# Altium schematic sheet Steering Wheel Interface.SchDoc: Title
size B; Organization: Midnight Sun Solar Rayce Car Team; Address1: University of Waterloo; Address2: 200 University Ave W; Address3: Waterloo, ON, Canada; Address4: N2L 3E9; Website: www.uwmidsun.com; ProjectName: ProjectName
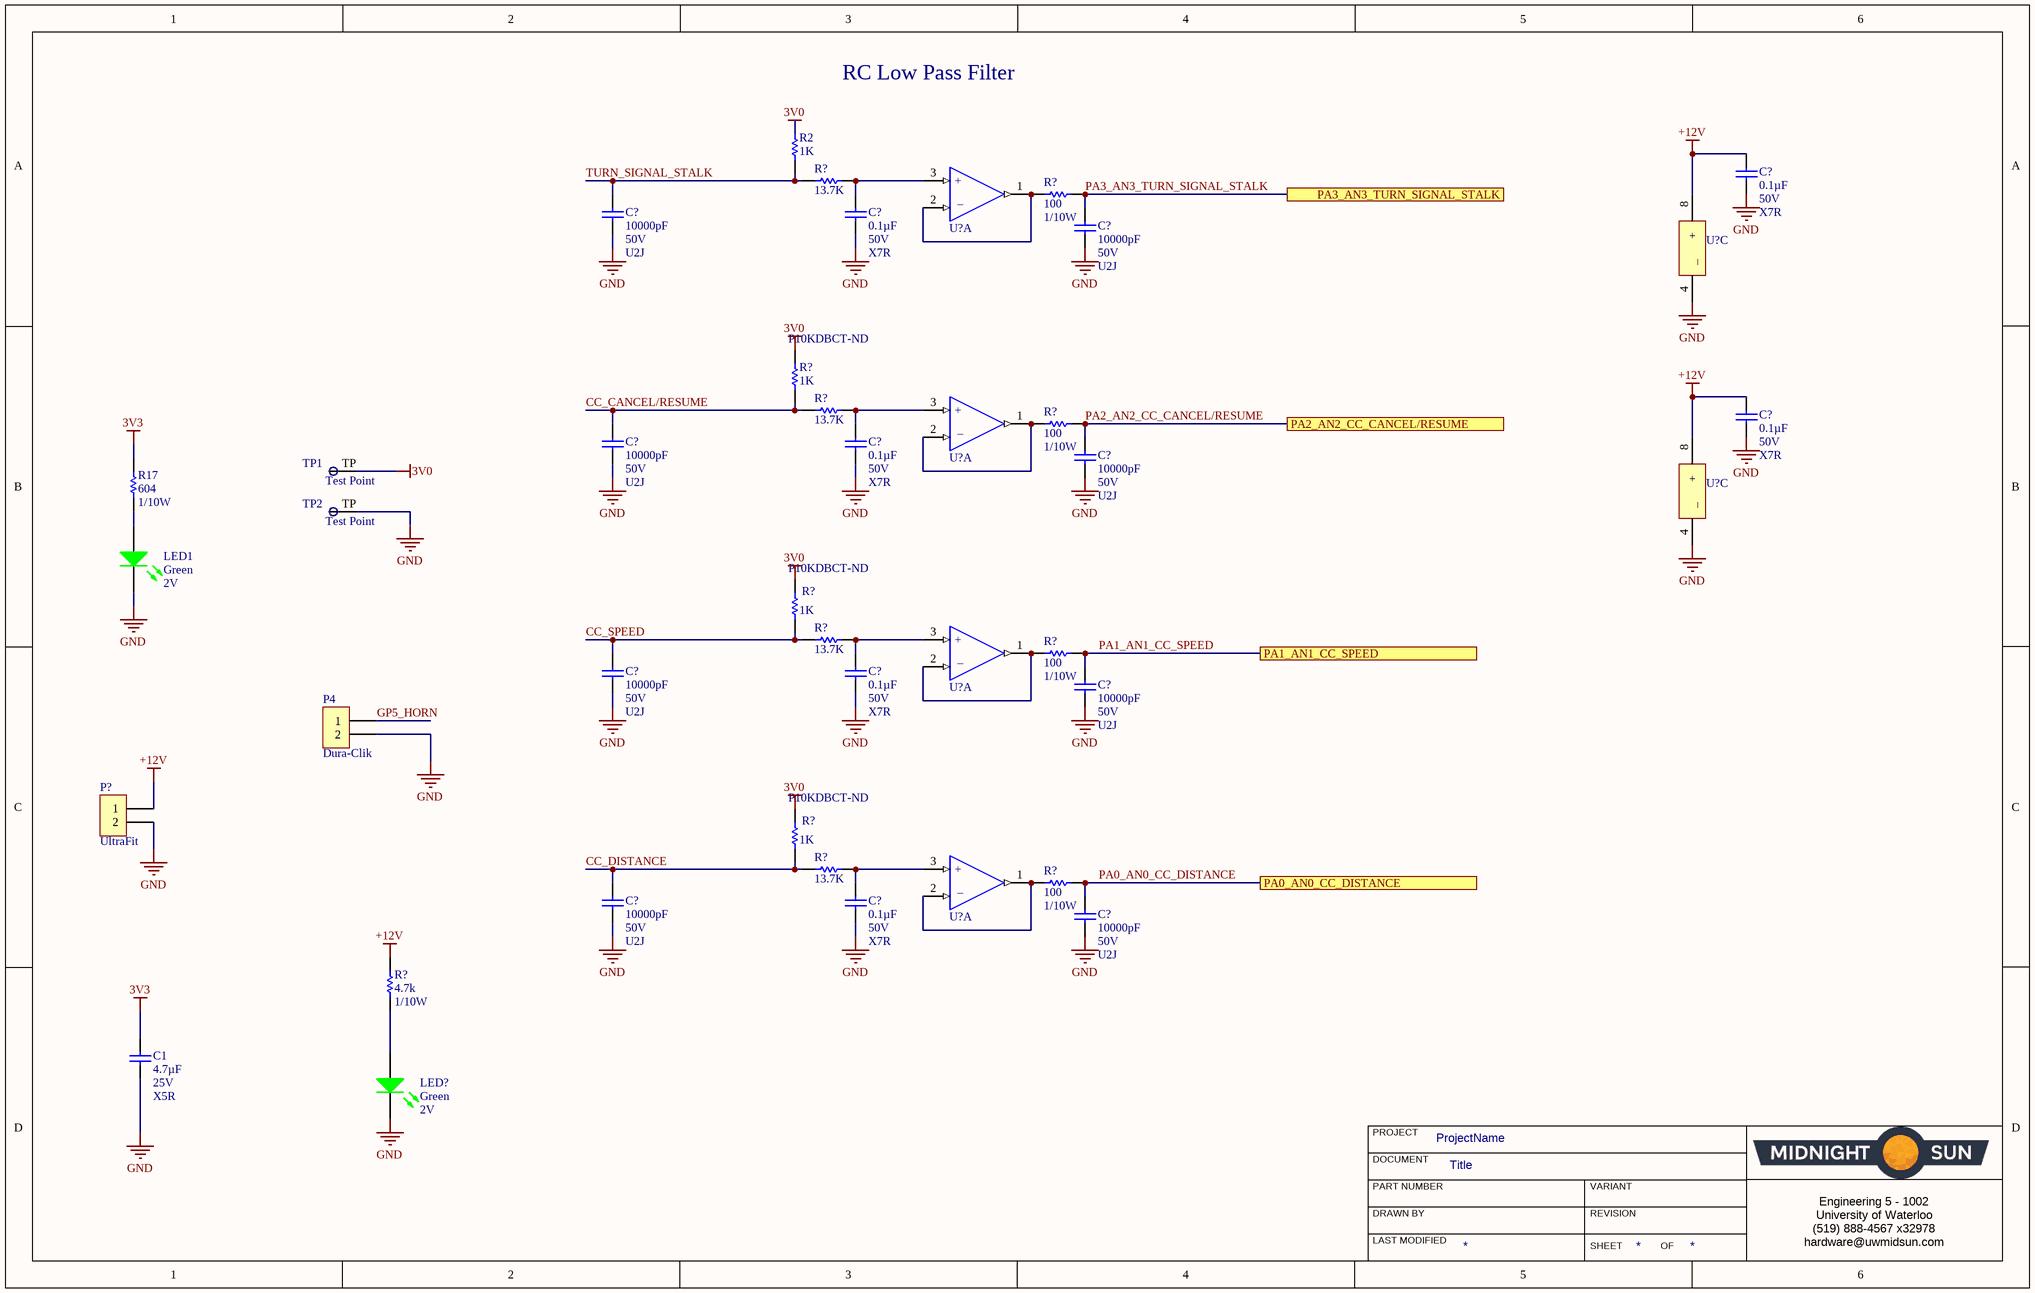
[diagram p0: Steering Wheel Interface.SchDoc]

## Parts
(Parts that share a designator on the sheet are numbered #1, #2 ... from top to bottom, then left to right.)
C1  Capacitance: 4.7µF  Voltage: 25V  Temperature Coefficient: X5R  [CAP, 0603]  (hidden comment: CAP CER 4.7UF 25V 10% X5R 0603)
C?#1  Capacitance: 0.1µF  Voltage: 50V  Temperature Coefficient: X7R  [CAP, 0603]  (hidden comment: CAP CER 0.1UF 50V 10% X7R 0603)
C?#2  Capacitance: 10000pF  Voltage: 50V  Temperature Coefficient: U2J  [CAP, 0603]  (hidden comment: CAP CER 10nF 50V 5% X7R 0603)
C?#3  Capacitance: 0.1µF  Voltage: 50V  Temperature Coefficient: X7R  [CAP, 0603]  (hidden comment: CAP CER 0.1UF 50V 10% X7R 0603)
C?#4  Capacitance: 10000pF  Voltage: 50V  Temperature Coefficient: U2J  [CAP, 0603]  (hidden comment: CAP CER 10nF 50V 5% X7R 0603)
C?#5  Capacitance: 0.1µF  Voltage: 50V  Temperature Coefficient: X7R  [CAP, 0603]  (hidden comment: CAP CER 0.1UF 50V 10% X7R 0603)
C?#6  Capacitance: 10000pF  Voltage: 50V  Temperature Coefficient: U2J  [CAP, 0603]  (hidden comment: CAP CER 10nF 50V 5% X7R 0603)
C?#7  Capacitance: 0.1µF  Voltage: 50V  Temperature Coefficient: X7R  [CAP, 0603]  (hidden comment: CAP CER 0.1UF 50V 10% X7R 0603)
C?#8  Capacitance: 10000pF  Voltage: 50V  Temperature Coefficient: U2J  [CAP, 0603]  (hidden comment: CAP CER 10nF 50V 5% X7R 0603)
C?#9  Capacitance: 10000pF  Voltage: 50V  Temperature Coefficient: U2J  [CAP, 0603]  (hidden comment: CAP CER 10nF 50V 5% X7R 0603)
C?#10  Capacitance: 0.1µF  Voltage: 50V  Temperature Coefficient: X7R  [CAP, 0603]  (hidden comment: CAP CER 0.1UF 50V 10% X7R 0603)
C?#11  Capacitance: 10000pF  Voltage: 50V  Temperature Coefficient: U2J  [CAP, 0603]  (hidden comment: CAP CER 10nF 50V 5% X7R 0603)
C?#12  Capacitance: 10000pF  Voltage: 50V  Temperature Coefficient: U2J  [CAP, 0603]  (hidden comment: CAP CER 10nF 50V 5% X7R 0603)
C?#13  Capacitance: 0.1µF  Voltage: 50V  Temperature Coefficient: X7R  [CAP, 0603]  (hidden comment: CAP CER 0.1UF 50V 10% X7R 0603)
C?#14  Capacitance: 10000pF  Voltage: 50V  Temperature Coefficient: U2J  [CAP, 0603]  (hidden comment: CAP CER 10nF 50V 5% X7R 0603)
LED1  Color: Green  Voltage - Forward (Vf) (Typ): 2V  [LED_0603]  (hidden comment: LED GREEN CLEAR 2V 0603)
LED?  Color: Green  Voltage - Forward (Vf) (Typ): 2V  [LED_0603]  (hidden comment: LED GREEN CLEAR 2V 0603)
P4  Dura-Clik  [CONN, 2POS Dura-Click Vertical]
P?  Series: UltraFit  [CONN, 2POS ULTRA-FIT]  (hidden comment: CONN 2POS ULTRA-FIT 0.138")
R2  1K  [RES, 0603]
R17  Resistance: 604  Power: 1/10W  [RES, 0603]  (hidden comment: RES 604 OHM 1% 1/10W 0603)
R?#1  13.7K  [RES 1206]
R?#2  Resistance: 100  Power: 1/10W  [RES, 0603]  (hidden comment: RES 100 OHM 1% 1/10W 0603)
R?#3  1K  Supplier Part Number 1: P10KDBCT-ND  [RES, 0603]
R?#4  13.7K  [RES 1206]
R?#5  Resistance: 100  Power: 1/10W  [RES, 0603]  (hidden comment: RES 100 OHM 1% 1/10W 0603)
R?#6  1K  Supplier Part Number 1: P10KDBCT-ND  [RES, 0603]
R?#7  13.7K  [RES 1206]
R?#8  Resistance: 100  Power: 1/10W  [RES, 0603]  (hidden comment: RES 100 OHM 1% 1/10W 0603)
R?#9  1K  Supplier Part Number 1: P10KDBCT-ND  [RES, 0603]
R?#10  13.7K  [RES 1206]
R?#11  Resistance: 100  Power: 1/10W  [RES, 0603]  (hidden comment: RES 100 OHM 1% 1/10W 0603)
R?#12  Resistance (Ohms): 4.7k  Power (Watts): 1/10W  [RES, 0603]  (hidden comment: RES 4.7K OHM 1% 1/10W 0603)
TP1  Test Point  [Test Point]  (no BOM)
TP2  Test Point  [Test Point]  (no BOM)
U?#1  IC OP AMP DUAL GP RR 10MHZ 8-VSSOP  [IC OP AMP GP RR 10MHZ 8-VSSOP]  (value not drawn)  (part A of 3)
U?#2  IC OP AMP DUAL GP RR 10MHZ 8-VSSOP  [IC OP AMP GP RR 10MHZ 8-VSSOP]  (value not drawn)  (part C of 3)
U?#3  IC OP AMP DUAL GP RR 10MHZ 8-VSSOP  [IC OP AMP GP RR 10MHZ 8-VSSOP]  (value not drawn)  (part A of 3)
U?#4  IC OP AMP DUAL GP RR 10MHZ 8-VSSOP  [IC OP AMP GP RR 10MHZ 8-VSSOP]  (value not drawn)  (part C of 3)
U?#5  IC OP AMP DUAL GP RR 10MHZ 8-VSSOP  [IC OP AMP GP RR 10MHZ 8-VSSOP]  (value not drawn)  (part A of 3)
U?#6  IC OP AMP DUAL GP RR 10MHZ 8-VSSOP  [IC OP AMP GP RR 10MHZ 8-VSSOP]  (value not drawn)  (part A of 3)

## Ports
PA0_AN0_CC_DISTANCE, PA1_AN1_CC_SPEED, PA2_AN2_CC_CANCEL/RESUME, PA3_AN3_TURN_SIGNAL_STALK

## Nets
3V0: R2.1 R?#3.1 R?#6.1 R?#9.1 TP1.TP
3V3: C1.1 R17.1
+12V: C?#1.1 C?#5.1 P?.1 R?#12.1 U?#2.8(+) U?#4.8(+)
GND: C1.2 C?#1.2 C?#2.2 C?#3.2 C?#4.2 C?#5.2 C?#6.2 C?#7.2 C?#8.2 C?#9.2 C?#10.2 C?#11.2 C?#12.2 C?#13.2 C?#14.2 LED1.2(K) LED?.2(K) P4.2 P?.2 TP2.TP U?#2.4(_) U?#4.4(_)
CC_CANCEL/RESUME: C?#6.1 R?#3.2 R?#4.2
CC_DISTANCE: C?#12.1 R?#9.2 R?#10.2
CC_SPEED: C?#9.1 R?#6.2 R?#7.2
GP5_HORN: P4.1
PA0_AN0_CC_DISTANCE: C?#14.1 R?#11.1 ; port PA0_AN0_CC_DISTANCE
PA1_AN1_CC_SPEED: C?#11.1 R?#8.1 ; port PA1_AN1_CC_SPEED
PA2_AN2_CC_CANCEL/RESUME: C?#8.1 R?#5.1 ; port PA2_AN2_CC_CANCEL/RESUME
PA3_AN3_TURN_SIGNAL_STALK: C?#4.1 R?#2.1 ; port PA3_AN3_TURN_SIGNAL_STALK
TURN_SIGNAL_STALK: C?#2.1 R2.2 R?#1.2
NetC?#3_1: C?#3.1 R?#1.1 U?#1.3(+IN_A)
NetC?#7_1: C?#7.1 R?#4.1 U?#3.3(+IN_A)
NetC?#10_1: C?#10.1 R?#7.1 U?#5.3(+IN_A)
NetC?#13_1: C?#13.1 R?#10.1 U?#6.3(+IN_A)
NetLED1_1: LED1.1(A) R17.2
NetLED?_1: LED?.1(A) R?#12.2
NetR?#2_2: R?#2.2 U?#1.1(OUT_A) U?#1.2(-IN_A)
NetR?#5_2: R?#5.2 U?#3.1(OUT_A) U?#3.2(-IN_A)
NetR?#8_2: R?#8.2 U?#5.1(OUT_A) U?#5.2(-IN_A)
NetR?#11_2: R?#11.2 U?#6.1(OUT_A) U?#6.2(-IN_A)

## Notes on the sheet
- RC Low Pass Filter
- PROJECT
- DOCUMENT
- DRAWN BY
- LAST MODIFIED
- PART NUMBER
- REVISION
- SHEET
- VARIANT
- OF
- Engineering 5 - 1002
  University of Waterloo
  (519) 888-4567 x32978
  hardware@uwmidsun.com

## Library data of the parts
C1 = CAP CER 4.7UF 25V 10% X5R 0603: 4.7µF ±10% 25V Ceramic Capacitor X5R 0603 (1608 Metric); Manufacturer 1: Murata Electronics North America; Manufacturer Part Number 1: GRM188R61E475KE11D; Supplier 1: Digi-Key; Supplier Part Number 1: 490-7203-1-ND; Packaging: Cut Tape (CT); Part Status: Active; Operating Temperature: -55°C ~ 85°C; Ratings: -; Mounting Type: Surface Mount, MLCC; Package / Case: 0603 (1608 Metric); Size / Dimension: 0.063" L x 0.031" W (1.60mm x 0.80mm); Height - Seated (Max): -; Thickness (Max): 0.031" (0.80mm); Lead Spacing: -; Lead Style: -; ComponentLink1URL: http://www.murata.com/~/media/webrenewal/support/library/catalog/products/capacitor/mlcc/c02e.ashx; ComponentLink1Description: http://www.murata.com/~/media/webrenewal/support/library/catalog/products/capacitor/mlcc/c02e.ashx; Tolerance: ±10%
C?#1 C?#3 C?#5 C?#7 C?#10 C?#13 = CAP CER 0.1UF 50V 10% X7R 0603: 0.10µF ±10% 50V Ceramic Capacitor X7R 0603 (1608 Metric); Manufacturer 1: AVX Corporation; Manufacturer Part Number 1: 06035C104KAT2A; Supplier 1: Digi-Key; Supplier Part Number 1: 478-5052-1-ND; Packaging: Cut Tape (CT); Part Status: Active; Operating Temperature: -55°C ~ 125°C; Ratings: -; Mounting Type: Surface Mount, MLCC; Package / Case: 0603 (1608 Metric); Size / Dimension: 0.063" L x 0.032" W (1.60mm x 0.81mm); Height - Seated (Max): -; Thickness (Max): 0.035" (0.90mm); Lead Spacing: -; Lead Style: -; ComponentLink1URL: http://datasheets.avx.com/X7RDielectric.pdf; ComponentLink1Description: http://datasheets.avx.com/X7RDielectric.pdf; Tolerance: ±10%
C?#2 C?#4 C?#6 C?#8 C?#9 C?#11 C?#12 C?#14 = CAP CER 10nF 50V 5% X7R 0603: 10000pF ±5% 50V Ceramic Capacitor U2J 0603 (1608 Metric); Manufacturer 1: KEMET; Manufacturer Part Number 1: C0603C103J5JAC7867; Supplier 1: Digi-Key; Supplier Part Number 1: 399-13384-1-ND; Packaging: Cut Tape (CT); Part Status: Active; Operating Temperature: -55°C ~ 125°C; Ratings: -; Failure Rate: -; Mounting Type: Surface Mount, MLCC; Package / Case: 0603 (1608 Metric); Size / Dimension: 0.063" L x 0.032" W (1.60mm x 0.80mm); Height - Seated (Max): -; Thickness (Max): 0.034" (0.87mm); Lead Spacing: -; Lead Style: -; ComponentLink1URL: http://www.kemet.com/docfinder?Partnumber=C0603C103J5JAC7867; ComponentLink1Description: http://www.kemet.com/docfinder?Partnumber=C0603C103J5JAC7867; Tolerance: ±5%
LED1 LED? = LED GREEN CLEAR 2V 0603: Green 572nm LED Indication - Discrete 2V 0603 (1608 Metric); Manufacturer: Wurth Electronics Inc.; Manufacturer Part Number: 150060VS75000; Lens Color: Colorless; Millicandela Rating: 40mcd; Lens Style/Size: Rectangle with Flat Top, 1.10mm x 0.70mm; Current - Test: 20mA; Viewing Angle: 140°; Wavelength - Dominant: 570nm; Supplier 1: Digi-Key; RoHS: RoHS Compliant; Category: Optoelectronics; Stock 1: 9408; Pricing 1: 1=0.21, 100=0.1617, 500=0.13964 (CAD); Packaging: Cut Tape (CT); Part Status: Active; Lens Transparency: Clear; Mounting Type: Surface Mount; Wavelength - Peak: 572nm; Features: -; Package / Case: 0603 (1608 Metric); Supplier Device Package: 0603; Size / Dimension: 1.60mm L x 0.80mm W; Height (Max): 0.80mm; ComponentLink1URL: http://katalog.we-online.de/led/datasheet/150060VS75000.pdf; ComponentLink1Description: http://katalog.we-online.de/led/datasheet/150060VS75000.pdf; Supplier Part Number 1: 732-4980-1-ND
P4 = CONN 2POS DURA-CLIK 0.079" VERT: 2 Positions Header, Shrouded Connector 0.079" (2.00mm) Surface Mount, Vertical Tin; Manufacturer: Molex, LLC; Manufacturer Part Number: 5600200220; Style: Board to Cable/Wire; Shrouding: Shrouded - 4 Wall; Number of Positions: 2; Number of Positions Loaded: All; Mated Stacking Heights: 9.3mm; Supplier 1: Digi-Key; RoHS: RoHS Compliant; Category: Connectors, Interconnects; Stock 1: 11912; Pricing 1: 1=1.16, 10=1.012, 25=0.952, 50=0.9122, 100=0.8727, 250=0.79336 (CAD); Packaging: Cut Tape (CT); Part Status: Active; Connector Type: Header; Contact Type: Male Pin; Pitch - Mating: 0.079" (2.00mm); Number of Rows: 1; Row Spacing - Mating: -; Mounting Type: Surface Mount; Termination: Solder; Fastening Type: Latch Lock; Contact Length - Mating: -; Contact Length - Post: -; Overall Contact Length: -; Insulation Height: 0.315" (8.00mm); Contact Shape: Square; Contact Finish - Mating: Tin; Contact Finish Thickness - Mating: -; Contact Finish - Post: Tin; Contact Material: Copper Alloy; Insulation Material: Polyamide (PA), Nylon; Features: Solder Retention; Operating Temperature: -; Ingress Protection: -; Material Flammability Rating: -; Insulation Color: Natural; Current Rating: -; Voltage Rating: -; Contact Finish Thickness - Post: -; Applications: Automotive, Industrial; ComponentLink1URL: http://www.molex.com/pdm_docs/sd/5600200220_sd.pdf; ComponentLink1Description: http://www.molex.com/pdm_docs/sd/5600200220_sd.pdf; Supplier Part Number 1: WM10862CT-ND
P? = CONN 2POS ULTRA-FIT 0.138": 2 Positions Header, Shrouded Connector 0.138" (3.50mm) Through Hole Gold; Manufacturer 1: Molex, LLC; Manufacturer Part Number 1: 1722861302; Style: Board to Board or Cable; Shrouding: Shrouded - 4 Wall; Number of Positions: 2; Number of Positions Loaded: All; Contact Length - Post: 0.126" (3.20mm); Material Flammability Rating: UL94 V-0; Mated Stacking Heights: 26.99mm; Voltage: 400V; Supplier 1: Digi-Key; Supplier Part Number 1: WM11673-ND; Packaging: Tray; Part Status: Active; Connector Type: Header; Contact Type: Male Pin; Pitch - Mating: 0.138" (3.50mm); Number of Rows: 1; Row Spacing - Mating: -; Mounting Type: Through Hole; Termination: Kinked Pin, Solder; Fastening Type: Latch Holder; Contact Length - Mating: -; Overall Contact Length: -; Insulation Height: 0.465" (11.80mm); Contact Shape: Square; Contact Finish - Mating: Gold; Contact Finish Thickness - Mating: 30µin (0.76µm); Contact Finish - Post: Tin; Contact Material: Copper Alloy; Insulation Material: Liquid Crystal Polymer (LCP); Operating Temperature: -40°C ~ 120°C; Ingress Protection: -; Insulation Color: Black; Current Rating: -; Contact Finish Thickness - Post: 60µin (1.52µm); ComponentLink1URL: http://www.molex.com/pdm_docs/sd/1722861302_sd.pdf; ComponentLink1Description: http://www.molex.com/pdm_docs/sd/1722861302_sd.pdf
R2 R?#3 R?#6 R?#9 = RES SMD 1K OHM 0.1% 1/10W 0603: 1 kOhms ±0.1% 0.1W, 1/10W Chip Resistor 0603 (1608 Metric) Automotive AEC-Q200 Thin Film; Manufacturer: Panasonic; Manufacturer Part Number: ERA3AEB103V; Resistance: 10kR; Power Rating: 100mW; Voltage Rating: 75V; Temperature Coefficient: 25ppm/°C; ComponentLink1URL: https://www.digikey.ca/product-detail/en/panasonic-electronic-components/ERA-3AEB102V/P1.0KDBCT-ND/1466052; ComponentLink1Description: Digikey; Supplier 1: Digi-Key; RoHS: Yes; Stock 1: 2747820; Pricing 1: 1 = 0.35000, 10 = 0.30000, 100 = 0.11720, 1000 = 0.04906, 2500 = 0.04498 (USD); Mount: Surface Mount; Case/Package: 0603; Number of Pins: 2; Case Code (Metric): 1608; Case Code (Imperial): 0603; Contact Plating: Tin; Min Operating Temperature: -55°C; Max Operating Temperature: 155°C; Packaging: Tape and Reel; Tolerance: 0.1%; Package Quantity: 5000; Composition: Metal Film,Thin Film; Number of Terminations: 2; Termination: SMD/SMT; Military Standard: Not; Max Power Dissipation: 100mW; Voltage Rating (DC): 75V; Length: 1.6mm; Height: 0.45mm; Width: 0.8mm; Depth: 0.8mm; Radiation Hardening: No; REACH SVHC: No SVHC; Lead Free: Lead Free; ComponentLink2URL: http://www.farnell.com/datasheets/485442.pdf; ComponentLink2Description: http://www.farnell.com/datasheets/485442.pdf; ComponentLink3URL: http://industrial.panasonic.com/www-data/pdf/AOA0000/AOA0000CE26.pdf; ComponentLink3Description: http://industrial.panasonic.com/www-data/pdf/AOA0000/AOA0000CE26.pdf; ComponentLink4URL: http://www.farnell.com/datasheets/2052875.pdf; ComponentLink4Description: http://www.farnell.com/datasheets/2052875.pdf; ComponentLink5URL: http://www.farnell.com/datasheets/1776116.pdf; ComponentLink5Description: http://www.farnell.com/datasheets/1776116.pdf; ComponentLink6URL: http://uk.rs-online.com/webdocs/148c/0900766b8148c4ab.pdf; ComponentLink6Description: http://uk.rs-online.com/webdocs/148c/0900766b8148c4ab.pdf; ComponentLink7URL: http://www.farnell.com/datasheets/2059650.pdf; ComponentLink7Description: http://www.farnell.com/datasheets/2059650.pdf; ComponentLink8URL: http://www.produktinfo.conrad.com/datenblaetter/450000-474999/451250-da-01-en-WIDERSTAND_0603_ERA.pdf; ComponentLink8Description: http://www.produktinfo.conrad.com/datenblaetter/450000-474999/451250-da-01-en-WIDERSTAND_0603_ERA.pdf
  R2: Supplier Part Number 1: P10KDBCT-ND
R17 = RES 604 OHM 1% 1/10W 0603: RES SMD 604 OHM 1% 1/10W 0603; Manufacturer 1: Yageo; Manufacturer Part Number 1: RC0603FR-07604RL; Temperature Coefficient: ±100ppm/°C; Supplier 1: Digi-Key; Supplier Part Number 1: 311-604HRCT-ND; Packaging: Cut Tape (CT); Part Status: Active; Composition: Thick Film; Operating Temperature: -55°C ~ 155°C; Package / Case: 0603 (1608 Metric); Supplier Device Package: 0603; Size / Dimension: 0.063" L x 0.031" W (1.60mm x 0.80mm); Height - Seated (Max): 0.022" (0.55mm); Failure Rate: -; ComponentLink1URL: http://www.yageo.com/documents/recent/PYu-RC_Group_51_RoHS_L_7.pdf; ComponentLink1Description: http://www.yageo.com/documents/recent/PYu-RC_Group_51_RoHS_L_7.pdf; Tolerance: ±1%
R?#1 R?#4 R?#7 R?#10 = RES 13.7K OHM 1% 1/4W 1206: 13.7 kOhms ±1% 0.25W, 1/4W Chip Resistor 1206 (3216 Metric) Moisture Resistant Thick Film; Manufacturer: Yageo; Manufacturer Part Number: RC1206FR-0713K7L; Resistance: 13.7kR; Power Rating: 250mW; Voltage Rating: 200V; Temperature Coefficient: 100ppm/°C; Supplier 1: Digi-Key; Stock 1: 44928; Pricing 1: 1=0.1, 10=0.033, 100=0.0136, 1000=0.0061, 2500=0.00529 (USD); Case/Package: 1206; Case Code (Imperial): 1206; Case Code (Metric): 3216; Contact Plating: Tin,Matte; Min Operating Temperature: -55°C; Max Operating Temperature: 155°C; Tolerance: 1%; Packaging: Tape and Reel; Termination: SMD/SMT; Composition: Thick Film; Military Standard: Not; Voltage Rating (DC): 200V; Length: 3.1mm; Height: 0.55mm; Width: 1.6mm; Depth: 1.6mm; Radiation Hardening: No; Lead Free: Lead Free; ComponentLink1URL: http://components.arrow.com/part/dataview/0323_03537901; ComponentLink1Description: http://components.arrow.com/part/dataview/0323_03537901; ComponentLink2URL: http://www.yageo.com/documents/recent/PYu-RC_Group_51_RoHS_L_2.pdf; ComponentLink2Description: http://www.yageo.com/documents/recent/PYu-RC_Group_51_RoHS_L_2.pdf; ComponentLink3URL: http://www.yageo.com/documents/recent/PYu-RC1206_51_RoHS_L-4.pdf; ComponentLink3Description: http://www.yageo.com/documents/recent/PYu-RC1206_51_RoHS_L-4.pdf; ComponentLink4URL: http://www.yageo.com.tw/exep/pages/download/literatures/PYu-R_INT-thick_7.pdf; ComponentLink4Description: http://www.yageo.com.tw/exep/pages/download/literatures/PYu-R_INT-thick_7.pdf; ComponentLink5URL: http://www.mouser.com/ds/2/447/PYu-RC1206_51_RoHS_L-4-349080.pdf; ComponentLink5Description: http://www.mouser.com/ds/2/447/PYu-RC1206_51_RoHS_L-4-349080.pdf; ComponentLink6URL: http://www.yageo.com/documents/recent/PYu-RC1206_51_RoHS_L_5.pdf; ComponentLink6Description: http://www.yageo.com/documents/recent/PYu-RC1206_51_RoHS_L_5.pdf; Supplier Part Number 1: 311-13.7KFRCT-ND
R?#2 R?#5 R?#8 R?#11 = RES 100 OHM 1% 1/10W 0603: 100 Ohm ±1% 0.1W, 1/10W Chip Resistor 0603 (1608 Metric) Moisture Resistant Thick Film; Manufacturer 1: Yageo; Manufacturer Part Number 1: RC0603FR-07100RL; Temperature Coefficient: ±100ppm/°C; Supplier 1: Digi-Key; Supplier Part Number 1: 311-100HRCT-ND; Packaging: Cut Tape (CT); Part Status: Active; Composition: Thick Film; Operating Temperature: -55°C ~ 155°C; Package / Case: 0603 (1608 Metric); Supplier Device Package: 0603; Size / Dimension: 0.063" L x 0.031" W (1.60mm x 0.80mm); Height - Seated (Max): 0.022" (0.55mm); Failure Rate: -; ComponentLink1URL: http://www.yageo.com/documents/recent/PYu-RC_Group_51_RoHS_L_7.pdf; ComponentLink1Description: http://www.yageo.com/documents/recent/PYu-RC_Group_51_RoHS_L_7.pdf; Tolerance: ±1%
R?#12 = RES 4.7K OHM 1% 1/10W 0603: 4.7k Ohm ±1% 0.1W, 1/10W Chip Resistor 0603 (1608 Metric) Moisture Resistant Thick Film; Manufacturer 1: Yageo; Manufacturer Part Number 1: RC0603FR-074K7L; Description 1: RES SMD 4.7K OHM 1% 1/10W 0603; Temperature Coefficient: ±100ppm/°C; Supplier 1: Digi-Key; Supplier Part Number 1: 311-4.70KHRCT-ND; RoHS: RoHS Compliant; Category: Resistors; Stock 1: 3487566; Pricing 1: 1=0.16, 10=0.022, 100=0.0089, 1000=0.00402, 2500=0.00349 (CAD); Packaging: Cut Tape (CT); Part Status: Active; Composition: Thick Film; Features: Moisture Resistant; Operating Temperature: -55°C ~ 155°C; Package / Case: 0603 (1608 Metric); Supplier Device Package: 0603; Size / Dimension: 0.063" L x 0.031" W (1.60mm x 0.80mm); Height - Seated (Max): 0.022" (0.55mm); Failure Rate: -; ComponentLink1URL: http://www.yageo.com/documents/recent/PYu-RC_Group_51_RoHS_L_7.pdf; ComponentLink1Description: http://www.yageo.com/documents/recent/PYu-RC_Group_51_RoHS_L_7.pdf; Tolerance: ±1%
U?#1-U?#6 = IC OP AMP DUAL GP RR 10MHZ 8-VSSOP: General Purpose Amplifier 2 Circuit Rail-to-Rail 8-VSSOP; Manufacturer: Texas Instruments; Manufacturer Part Number: OPA2197IDGKR; Number of Circuits: 2; Slew Rate: 20V/µs; Input Bias Current: 5pA; Input Offset Voltage (Vos): 250uV; Operating Supply Current: 1mA; Output Current per Channel: 65mA; Supplier 1: Digi-Key; Stock 1: 2171; Pricing 1: 1=2.41, 10=2.162, 100=1.7376, 500=1.4276, 1000=1.1829 (USD); Mount: Surface Mount; Case/Package: VSSOP; Min Operating Temperature: -40°C; Max Operating Temperature: 125°C; Packaging: Tape and Reel; Gain Bandwidth Product: 10MHz; Number of Channels: 2; Lead Free: Lead Free; ComponentLink1URL: http://www.ti.com/lit/ds/symlink/opa2197.pdf; ComponentLink1Description: http://www.ti.com/lit/ds/symlink/opa2197.pdf; Supplier Part Number 1: 296-47349-1-ND